# Altium schematic sheet 51-2001-01-1_04 Power Module Schematic.SchDoc
size 431 x 279 mm; Organization: ORGANIZATION; Address1: ADDRESS 1; Address2: ADDRESS 2; Address3: ADDRESS 3; Address4: ADDRESS 4; Revision: -; SheetNumber: 4; SheetTotal: 4; ENG_APP_DATE: --/--/--; DSN_APP_DATE: --/--/--; CHK_APP_DATE: --/--/--
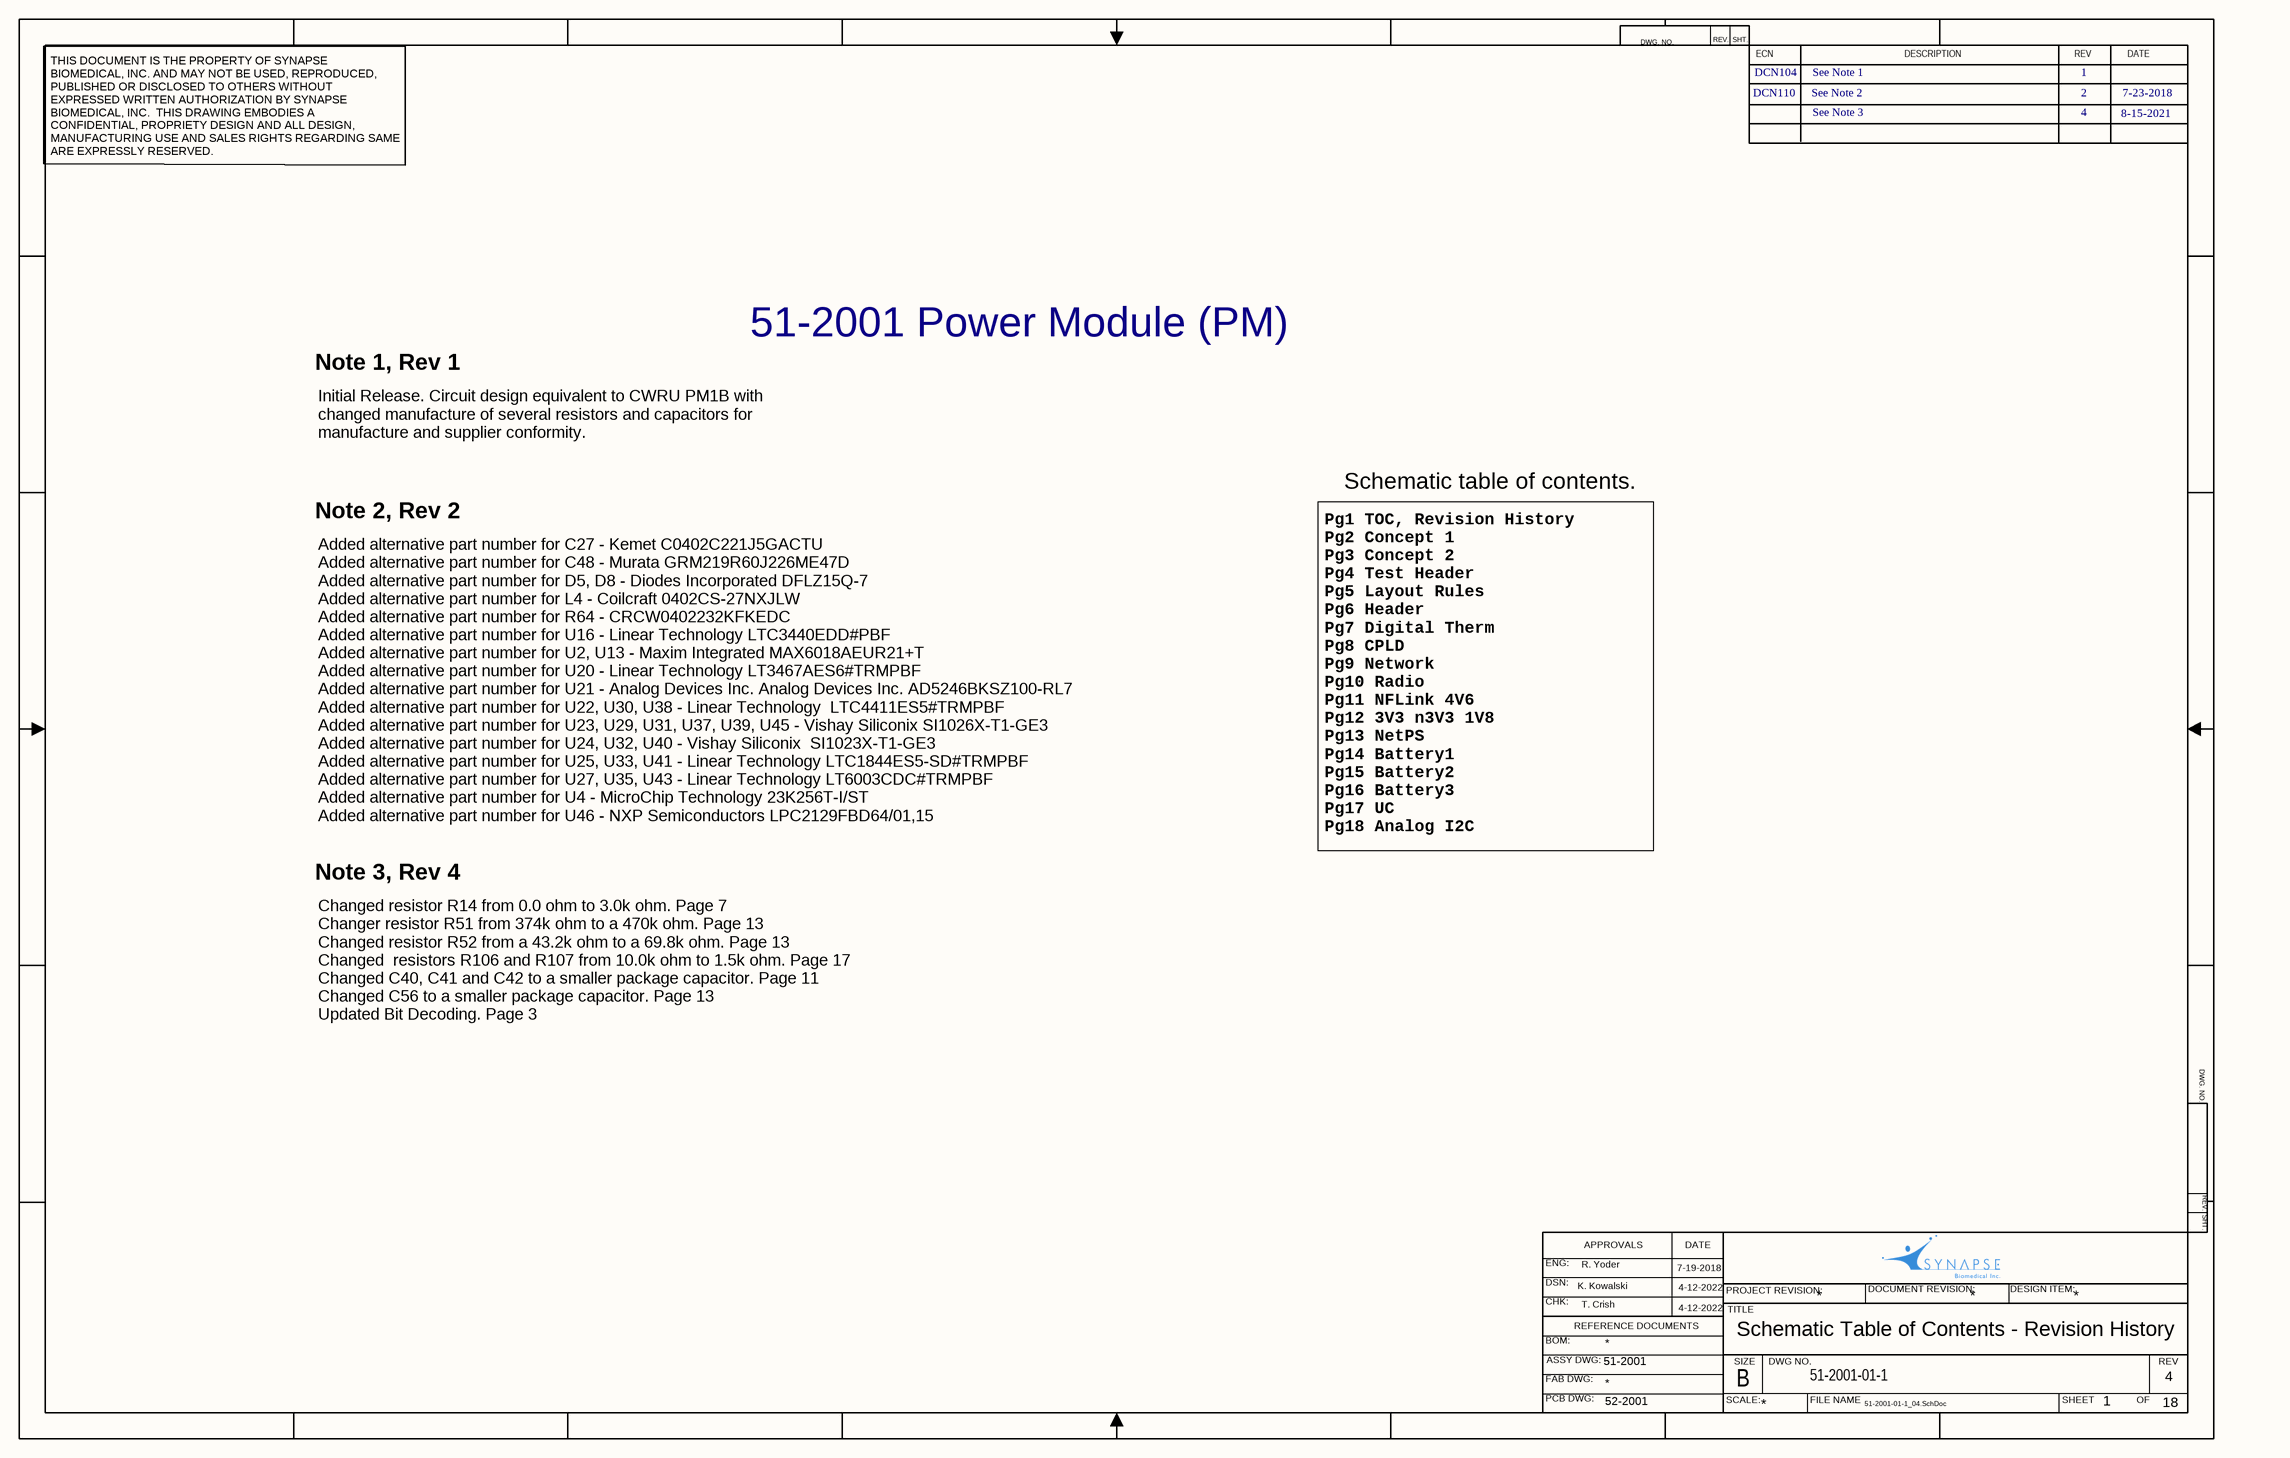
[diagram p0: 51-2001-01-1_04 Power Module Schematic.SchDoc]

## Notes on the sheet
- DWG. NO.
- REV.
- SHT.
- DCN110
- DCN104
- ECN
- See Note 2
- See Note 1
- DESCRIPTION
- REV
- 1
- 2
- 7-23-2018
- DATE
- THIS DOCUMENT IS THE PROPERTY OF SYNAPSE BIOMEDICAL, INC. AND MAY NOT BE USED, REPRODUCED, PUBLISHED OR DISCLOSED TO OTHERS WITHOUT EXPRESSED WRITTEN AUTHORIZATION BY SYNAPSE BIOMEDICAL, INC.  THIS DRAWING EMBODIES A CONFIDENTIAL, PROPRIETY DESIGN AND ALL DESIGN, MANUFACTURING USE AND SALES RIGHTS REGARDING SAME ARE EXPRESSLY RESERVED.
- See Note 3
- 4
- 8-15-2021
- 51-2001 Power Module (PM)
- Note 1, Rev 1
- Initial Release. Circuit design equivalent to CWRU PM1B with
  changed manufacture of several resistors and capacitors for
  manufacture and supplier conformity.
- Schematic table of contents.
- Note 2, Rev 2
- Note 3, Rev 4
- Added alternative part number for C27 - Kemet C0402C221J5GACTU
  Added alternative part number for C48 - Murata GRM219R60J226ME47D
  Added alternative part number for D5, D8 - Diodes Incorporated DFLZ15Q-7
  Added alternative part number for L4 - Coilcraft 0402CS-27NXJLW
  Added alternative part number for R64 - CRCW0402232KFKEDC
  Added alternative part number for U16 - Linear Technology LTC3440EDD#PBF
  Added alternative part number for U2, U13 - Maxim Integrated MAX6018AEUR21+T
  Added alternative part number for U20 - Linear Technology LT3467AES6#TRMPBF
  Added alternative part number for U21 - Analog Devices Inc. Analog Devices Inc. AD5246BKSZ100-RL7
  Added alternative part number for U22, U30, U38 - Linear Technology  LTC4411ES5#TRMPBF
  Added alternative part number for U23, U29, U31, U37, U39, U45 - Vishay Siliconix SI1026X-T1-GE3
  Added alternative part number for U24, U32, U40 - Vishay Siliconix  SI1023X-T1-GE3
  Added alternative part number for U25, U33, U41 - Linear Technology LTC1844ES5-SD#TRMPBF
  Added alternative part number for U27, U35, U43 - Linear Technology LT6003CDC#TRMPBF
  Added alternative part number for U4 - MicroChip Technology 23K256T-I/ST
  Added alternative part number for U46 - NXP Semiconductors LPC2129FBD64/01,15
- Pg1 TOC, Revision History
  Pg2 Concept 1
  Pg3 Concept 2
  Pg4 Test Header
  Pg5 Layout Rules
  Pg6 Header
  Pg7 Digital Therm
  Pg8 CPLD
  Pg9 Network
  Pg10 Radio
  Pg11 NFLink 4V6
  Pg12 3V3 n3V3 1V8
  Pg13 NetPS
  Pg14 Battery1
  Pg15 Battery2
  Pg16 Battery3
  Pg17 UC
  Pg18 Analog I2C
- Changed resistor R14 from 0.0 ohm to 3.0k ohm. Page 7
  Changer resistor R51 from 374k ohm to a 470k ohm. Page 13
  Changed resistor R52 from a 43.2k ohm to a 69.8k ohm. Page 13
  Changed  resistors R106 and R107 from 10.0k ohm to 1.5k ohm. Page 17
  Changed C40, C41 and C42 to a smaller package capacitor. Page 11                   Changed C56 to a smaller package capacitor. Page 13
  Updated Bit Decoding. Page 3
- ENG:
- R. Yoder
- APPROVALS
- 7-19-2018
- DSN:
- CHK:
- REFERENCE DOCUMENTS
- K. Kowalski
- T. Crish
- 4-12-2022
- PROJECT REVISION:
- TITLE
- Schematic Table of Contents - Revision History
- *
- DOCUMENT REVISION:
- DESIGN ITEM:
- BOM:
- FAB DWG:
- PCB DWG:
- ASSY DWG:
- 51-2001
- SCALE:
- SIZE
- B
- DWG NO.
- 51-2001-01-1
- FILE NAME
- SHEET
- OF
- 52-2001
- 51-2001-01-1_04.SchDoc
- 18